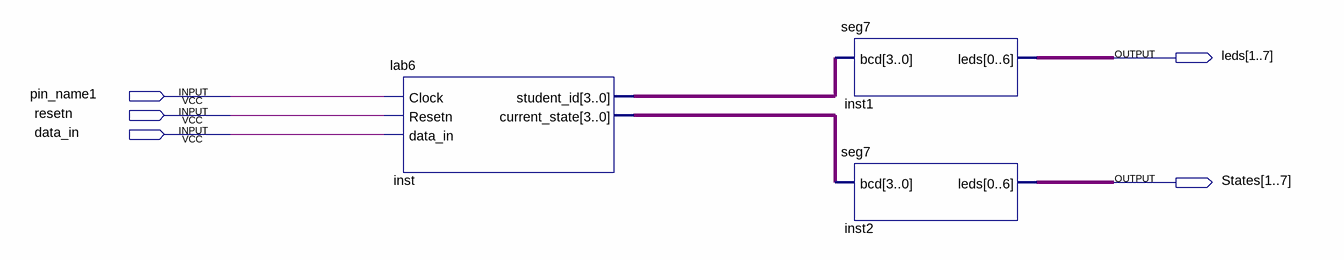
[diagram p0: schematic sheet]
// Quartus schematic FBGA.bdf as structural Verilog: 3 symbols, 5 pins
module FBGA (
  input  pin_name1,
  input  resetn,
  input  data_in,
  output [1:7] leds,
  output [1:7] States
);

  wire [3:0] inst_current_state, inst_student_id;

  lab6 inst (
    .Clock(pin_name1), .Resetn(resetn), .data_in(data_in), .student_id(inst_student_id),
    .current_state(inst_current_state));
  seg7 inst1 (.bcd(inst_student_id), .leds(leds));
  seg7 inst2 (.bcd(inst_current_state), .leds(States));
endmodule
